# EAGLE design picopsh (EAGLE 6.2)
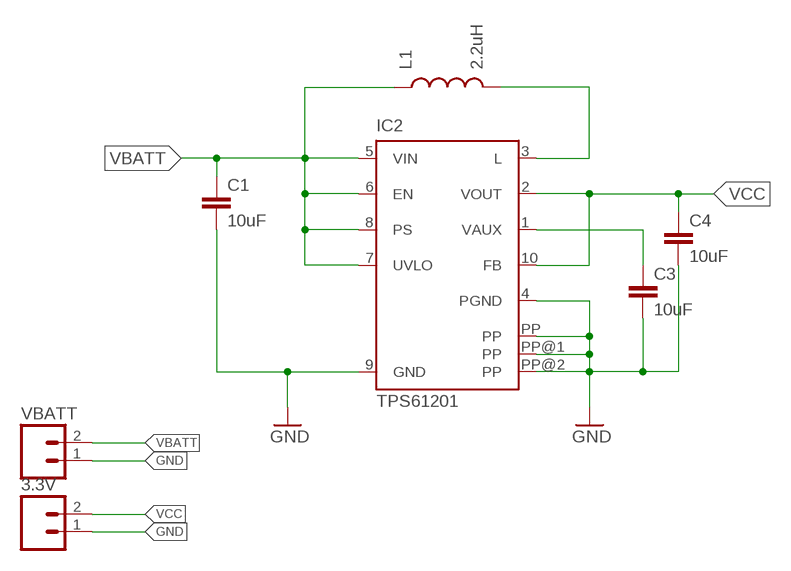
[diagram p0: schematic, sheet 1]

## Parts
3.3V  M02PTH  [1X02]
C1  10uF  CAP1206  [1206]
C3  10uF  CAP1206  [1206]
C4  10uF  CAP1206  [1206]
IC2  TPS61201  [S-PDSO-N10]
L1  2.2uH  ELLVGG_INDUCTOR  [ELLVGG_INDUCTOR]
VBATT  M02PTH  [1X02]

## Nets
GND [vcc]: 3.3V.1 C1.2 C3.2 C4.2 IC2.4(PGND) IC2.9(GND) IC2.PP IC2.PP@1(PP) IC2.PP@2(PP) VBATT.1
N$7: IC2.3(L) L1.P$2
N$11: C3.1 IC2.1(VAUX)
VBATT [vcc]: C1.1 IC2.5(VIN) IC2.6(EN) IC2.7(UVLO) IC2.8(PS) L1.P$1 VBATT.2
VCC: 3.3V.2 C4.1 IC2.2(VOUT) IC2.10(FB)

## Library data of the parts
3.3V VBATT = SparkFun:M02: Header 2 Standard 2-pin 0.1" header. Use with straight break away headers (SKU : PRT-00116), right angle break away headers (PRT-00553), swiss pins (PRT-00743), machine pins (PRT-00117), and female headers (PRT-00115). Molex polarized connector foot print use with SKU : PRT-08233 with associated crimp pins and housings.
C1 C3 C4 = SparkFun:CAP: Capacitor Standard 0603 ceramic capacitor, and 0.1" leaded capacitor.
IC2 = texas:TPS6120*: LOW INPUT VOLTAGE SYNCHRONOUS BOOST CONVERTER WITH 1.3-A SWITCHES Source: http://focus.ti.com/lit/ds/symlink/tps61200.pdf; MPN: TPS61201DRCT; OC_FARNELL: unknown; OC_NEWARK: 37M0068
L1 = ava:ELLVGG_INDUCTOR

## Net classes
0 default: width 0.203 mm
1 vcc: width 0.254 mm

## Board
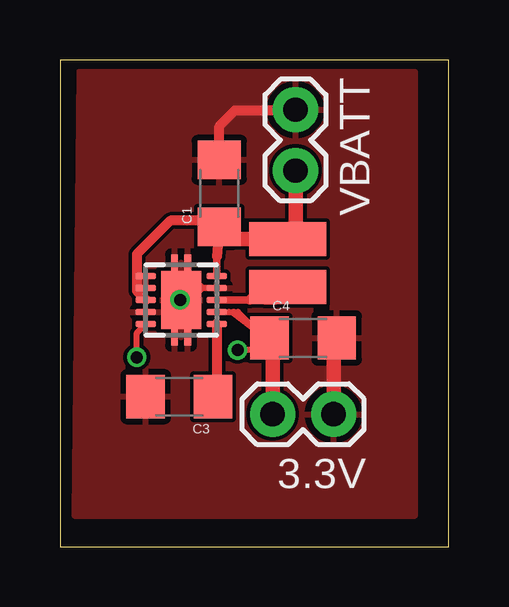
[diagram p1: board, top side]
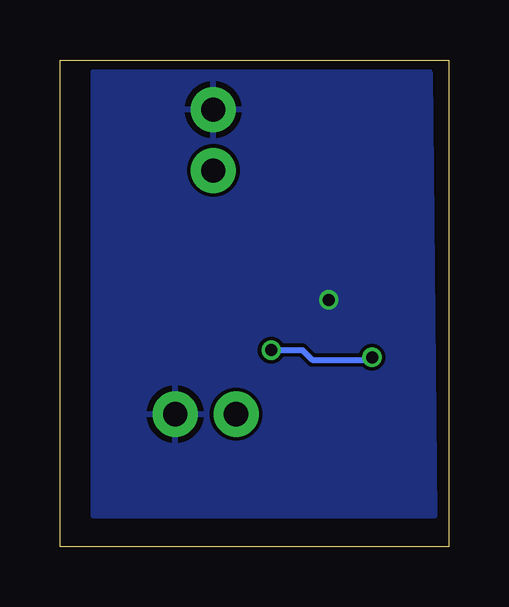
[diagram p2: board, bottom side, seen from below]

Size 16.2 x 20.3 mm. Coordinates in mm from the lower left corner, seen from the top.
Outline: 0,0 16.2,0 16.2,20.3 0,20.3 0,0
Copper layers (1*16): Top 0.035mm / dielectric 1.5mm / Bottom 0.035mm
Design rules: minimum track width 6mil, minimum drill 12mil, track to track 6mil, track to pad 6mil, pad to pad 6mil, via to via 6mil, smd to smd 0mil, copper to edge 10mil, drill to drill 10mil, minimum pad ring 10mil, minimum via ring 6mil, stop-mask expansion 2mil, vias tented up to drill 100mil, thermal gap 10mil

### Footprints (pad centres in the part's own frame; a part is rotated, then mirrored left to right if it is on the bottom)
1X02 = drill 1.016 pad 1.88: 1 0,0; 2 2.54,0
1206 = smd 1.6 x 1.8: 1 -1.4,0; 2 1.4,0
S-PDSO-N10 = smd 0.28 x 0.85: 1 -1,-1.475; 2 -0.5,-1.475; 3 0,-1.475; 4 0.5,-1.475; 5 1,-1.475; 6 1,1.475; 7 0.5,1.475; 8 0,1.475; 9 -0.5,1.475; 10 -1,1.475 | smd 2.4 x 1.65: PP 0,0 | smd 3.8 x 0.28: PP@1 0,0.275; PP@2 0,-0.275
ELLVGG_INDUCTOR = smd 1.4 x 3.2: P$1 -3.81,0; P$2 -1.81,0

### Placement (x,y rotation side)
3.3V  11.4,5.53 180 top
C1  6.64,14.73 90 top
C3  4.97,6.26 180 top
C4  10.13,8.7 0 top
IC2  5.05,10.29 90 top
L1  9.5,9.02 270 top
VBATT  9.81,18.23 270 top

### Tracks (layer width: path | path; a pad name or v marks a point on that pad's centre or on a via)
GND  (via drill 0.5)
  Top 0.254: IC2.4 5.82,10.79
  Top 0.406: C4.2 11.4,8.7 | C1.2 6.64,17.54 7.3,18.2 9.79,18.2 VBATT.1 | 5.82,10.79 IC2.PP@2
  Top 0.61: 11.4,8.7 3.3V.1
  other vias: 5,10.3
  pour Bottom: 0.6,1.3 14.5,1.3 14.8,1.3 14.8,19.8 0.8,19.8
  pour Top: 0.6,1.3 14.5,1.3 14.8,1.3 14.8,19.8 0.8,19.8
N$7
  Top 0.305: IC2.3 7.91,10.29
  Top 0.406: L1.P$2 8.96,10.29 8.54,10.29 8.22,10.61 7.91,10.29
N$11
  Top 0.406: IC2.1 6.53,6.4 C3.1
VBATT
  Top 0.254: 3.2,10.66 3.45,10.66 IC2.7 IC2.6
  Top 0.305: 6.54,12.1 IC2.5 6.53,12.77
  Top 0.406: 9.81,13.15 L1.P$1 | 7.14,12.83 C1.1 6.54,12.1 | 6.53,12.77 6.5,12.8 6.5,13.6 4.6,13.6 3.2,12.2 3.2,10.66 IC2.8
  Top 0.61: VBATT.2 9.81,13.15 | L1.P$1 7.14,12.83
VCC  (via drill 0.5)
  Top 0.254: 7.25,9.77 7.04,9.79 IC2.2 7.41,9.79 8.5,8.7 8.3,8.3 8.4,8.2 v7.4,8.2 | v3.2,7.9 3.2,8.91 IC2.10
  Top 0.305: 7.25,9.77 8.22,9.02
  Top 0.406: 8.22,9.02 8.41,9.02 C4.1 8.86,8.57
  Top 0.61: 3.3V.2 8.86,8.57
  Bottom 0.254: v7.4,8.2 6.1,8.2 5.7,7.8 3.3,7.8 v3.2,7.9